# EAGLE schematic 3518 (EAGLE 6.3)
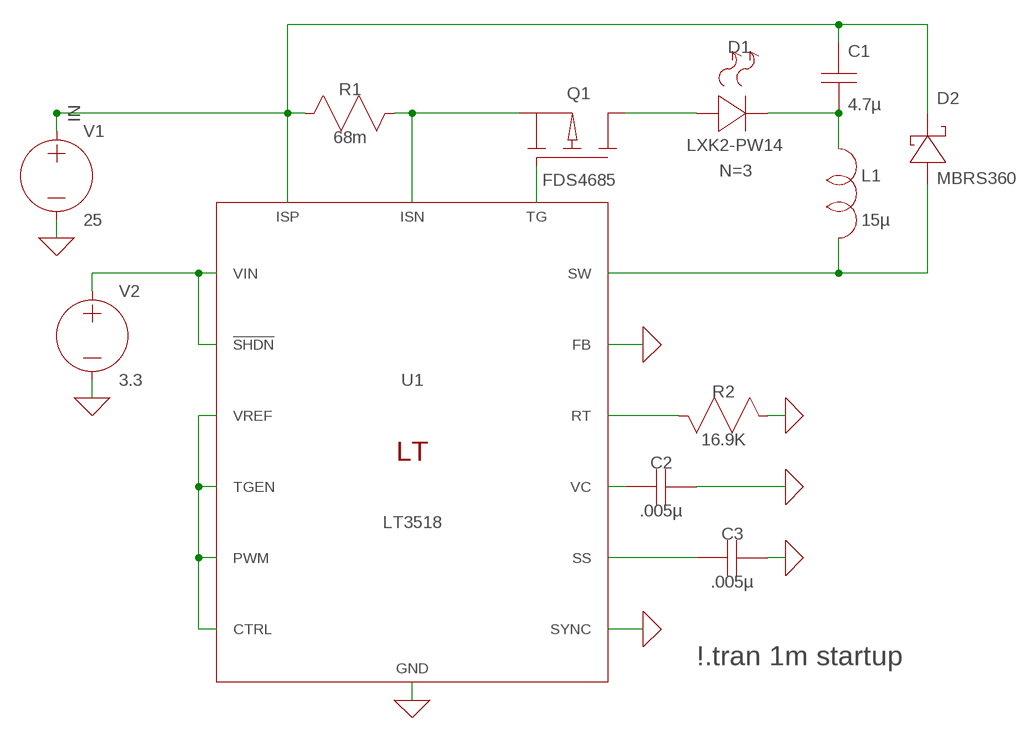
[diagram p0: schematic, sheet 1]

## Parts
C1  4.7µ  CAP  [C0805]
C2  .005µ  CAP  [C0805]
C3  .005µ  CAP  [C0805]
D1  LXK2-PW14  LED  [R0805]
D2  MBRS360  SCHOTTKY  [SOD123]
L1  15µ  IND  [L1812]
Q1  FDS4685  PMOS  [SOT23]
R1  68m  RES  [R0805]
R2  16.9K  RES  [R0805]
U1  LT3518  [TSSOP16BA(FE)]
V1  25  VOLTAGE  (no package)
V2  3.3  VOLTAGE  (no package)

## Nets
0: C2.2(B) C3.2(B) R2.2(B) U1.5(SYNC) U1.10(FB) U1.17(GND) V1.- V2.-
IN: C1.1(A) D2.C(-) R1.1(A) U1.13(ISP) V1.+
N$2: Q1.2(S) R1.2(B) U1.12(ISN)
N$3: D1.1(+) Q1.3(D)
N$4: C1.2(B) D1.2(-) L1.1(A)
N$5: Q1.1(G) U1.14(TG)
N$6: U1.1(VIN) U1.2(!SHDN) V2.+
N$8: D2.A(+) L1.2(B) U1.15(SW) U1.16(SW)
N$9: U1.3(VREF) U1.7(PWM) U1.8(CTRL) U1.11(TGEN)
N$10: R2.1(A) U1.4(RT)
N$11: C2.1(A) U1.9(VC)
N$12: C3.1(A) U1.6(SS)

## Notes on the sheet
- \!.tran 1m startup

## Library data of the parts
C1-C3 = sym:CAP: Capacitor
D1 = sym:LED: Light Emitting Diode; SPICEMODEL: NONE; SPICETYPE: diode; SPICE_DESCRIPTION: Diode; VALUE2: N=3
D2 = sym:SCHOTTKY: Schottky diode; SPICETYPE: diode; SPICE_DESCRIPTION: Diode
L1 = sym:IND: Inductor; SPICELINE: Rpar=2K
Q1 = sym:PMOS: P-Channel MOSFET transistor
R1 R2 = sym:RES: A resistor
U1 = PowerProducts:LT3518: LT-Spice library generated with : ltspice.ulp from: D:/Program Files (x86)/LTC/LTspiceIV/lib/sym/PowerProducts/LT3592*.asy at 07.10.2012 16:20:52; SPICEMODEL: LT3518.lib; SPICEPREFIX: X; VALUE2: LT3518
V1 V2 = lt-spice-simulation:VOLTAGE: Voltage Source, either DC, AC, PULSE, SINE, PWL, EXP, or SFFM